# Altium schematic sheet Display.SchDoc
size A4; SheetNumber: 1; SheetTotal: 1
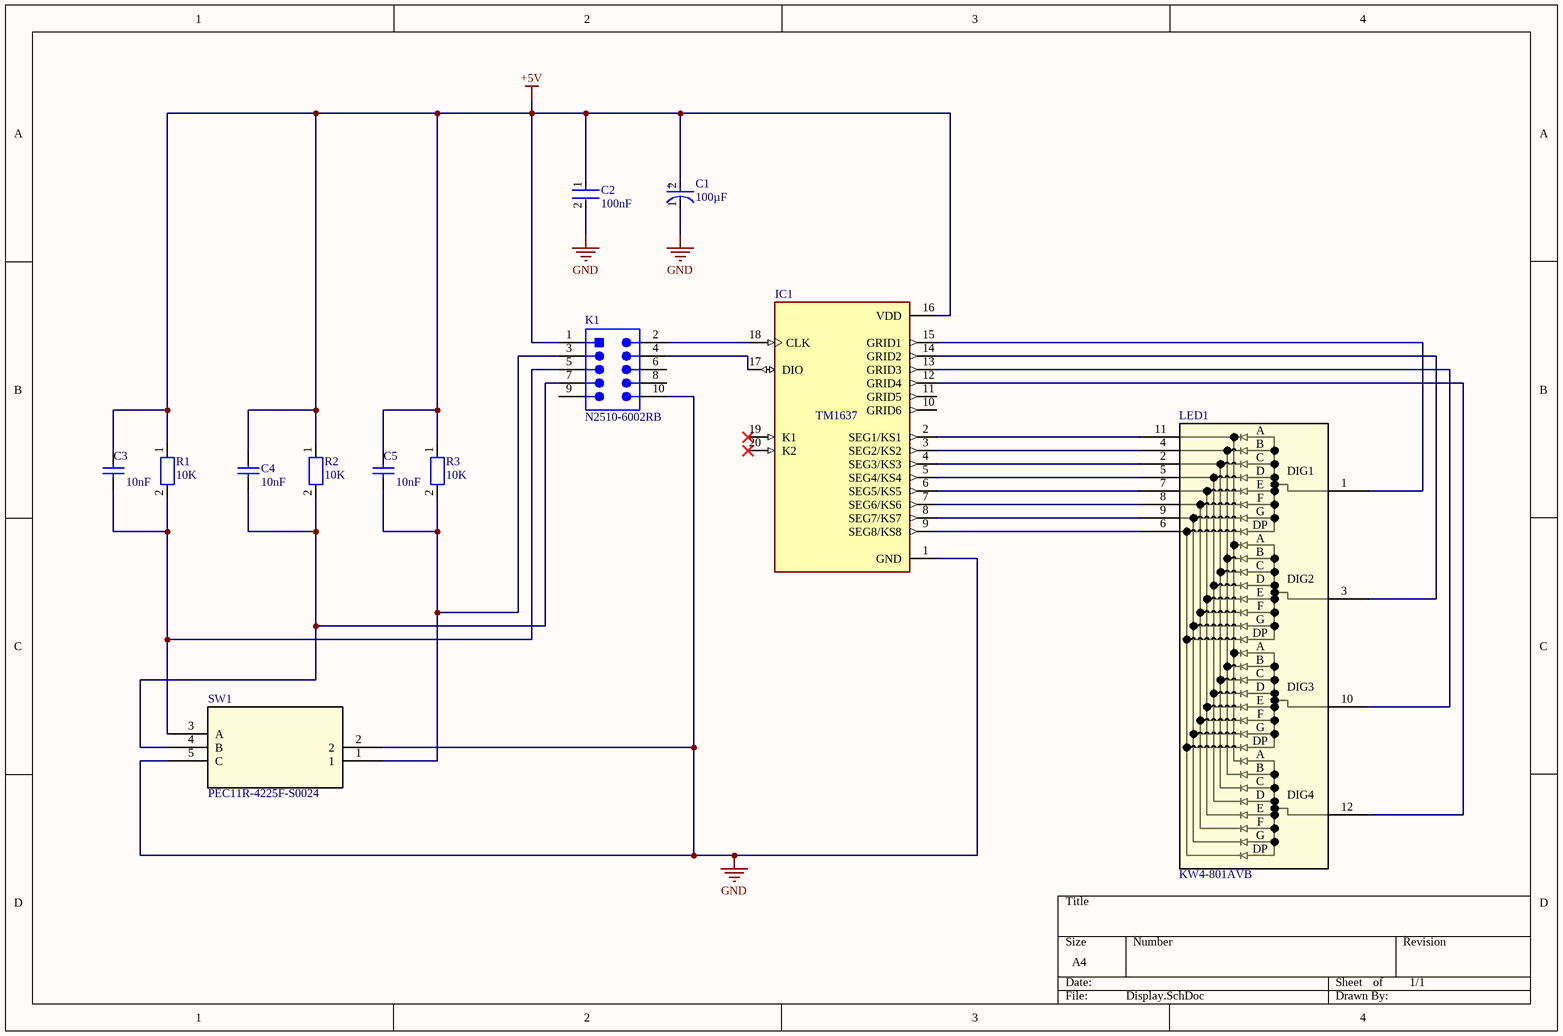
[diagram p0: Display.SchDoc]

## Parts
C1  100µF  [Cap 50V 100µF 8X11]
C2  100nF  [cap 50V 100nF A]
C3  10nF  [cap 10nF X7R 50V LL]
C4  10nF  [cap 10nF X7R 50V LL]
C5  10nF  [cap 10nF X7R 50V LL]
IC1  TM1637  [TM1637]
K1  N2510-6002RB  [boxheader]
LED1  KW4-801AVB  [KW4801AVB]
R1  10K  [Weerstand 10k ohm]
R2  10K  [Weerstand 10k ohm]
R3  10K  [Weerstand 10k ohm]
SW1  PEC11R-4225F-S0024  [SW5_PEC11R-4225F-S0024_BRN]

## Nets
+5V: C1.2(A) C2.1 C3.2 C4.2 C5.2 IC1.16(VDD) K1.1 R1.1 R2.1 R3.1
GND: C1.1(C) C2.2 IC1.1(GND) K1.10 SW1.2 SW1.5(C)
NetC3_1: C3.1 K1.5 R1.2 SW1.3(A)
NetC4_1: C4.1 K1.7 R2.2 SW1.4(B)
NetC5_1: C5.1 K1.3 R3.2 SW1.1
NetIC1_2: IC1.2(SEG1/KS1) LED1.11(CATHODE_A)
NetIC1_3: IC1.3(SEG2/KS2) LED1.4(CATHODE_B)
NetIC1_4: IC1.4(SEG3/KS3) LED1.2(CATHODE_C)
NetIC1_5: IC1.5(SEG4/KS4) LED1.5(CATHODE_D)
NetIC1_6: IC1.6(SEG5/KS5) LED1.7(CATHODE_E)
NetIC1_7: IC1.7(SEG6/KS6) LED1.8(CATHODE_F)
NetIC1_8: IC1.8(SEG7/KS7) LED1.9(CATHODE_G)
NetIC1_9: IC1.9(SEG8/KS8) LED1.6(CATHODE_DP)
NetIC1_12: IC1.12(GRID4) LED1.12(COMMON_ANODE_4)
NetIC1_13: IC1.13(GRID3) LED1.10(COMMON_ANODE_3)
NetIC1_14: IC1.14(GRID2) LED1.3(COMMON_ANODE_2)
NetIC1_15: IC1.15(GRID1) LED1.1(COMMON_ANODE_1)
NetIC1_17: IC1.17(DIO) K1.4
NetIC1_18: IC1.18(CLK) K1.2

Not connected (* = marked no-connect by the designer): IC1 10(GRID6) 11(GRID5) 19(K1)* 20(K2)*; K1 6 8 9

## Notes on the sheet
- (in symbol Cap 50V 100µF 8x11) +
- (in symbol KW4-801AVB) A; B; C; D; DIG1; E; F; G; DP; DIG2; DIG3; DIG4

## Library data of the parts
C1 = Cap 50V 100µF 8x11: Aluminum Electrolytic Capacitors (Radial Lead Type) AEC-Q200 Qualified 100uF ±20% 50V; Ripple Current (AC): 180mA; Polarity: Polar; Lead Diameter: 0.6mm; Life (Hours): 1000Hour; Lead/Base Style: Straight; Voltage Rating: 50V; Number of Pins: 2; Mount: Through Hole; Height: 11.5mm; Capacitance: 100uF; Packaging: Bulk; Diameter: 8mm; Min Operating Temperature: -55°C; Max Operating Temperature: 105°C; Case/Package: Radial; Lead Pitch: 3.5mm; Termination: Radial; Voltage: 50V; Package Quantity: 200; Construction: RADIAL; RoHS Compliant: Yes; Ripple Current: 180mA; Voltage Rating (DC): 50V; Series: HD; Tolerance: 20%; Length: 11.5mm; REACH SVHC: No SVHC; Height - Seated (Max): 0.512inch
C2 = cap 50V 100nF: Chip Multilayer Ceramic Capacitors for Automotive, 0805, 0.10uF, X7R, 15%, 10%, 50V, Grade 1; Case Code (Metric): 2012; Voltage Rating: 50V; Height: 1.25mm; Weight: 0.000335oz; Mount: Surface Mount; Width: 0.049inch; Packaging: Tape and Reel; Min Operating Temperature: -55°C; Depth: 1.25mm; Length: 2mm; Max Operating Temperature: 125°C; Ratings: AEC-Q200; Termination: SMD/SMT; Capacitance: 100nF; Thickness: 0.049inch; Case/Package: 0805; Voltage Rating (DC): 50V; Dielectric: X7R; Case Code (Imperial): 0805; Tolerance: 10%; Package Quantity: 3000
C3-C5 = cap 10nF X7R 50V: Part Number: VJ0805Y103KXACW1BC; Manufacturer: Vitramon
IC1 = TM1637: LED Drive Control Special Circuit; MF: Titan Micro Electronics; Package: Package; Availability: Not in stock; SnapEDA_Link: https://www.snapeda.com/parts/TM1637/Titan+Micro+Electronics/view-part/?ref=snap; MP: TM1637; Check_prices: https://www.snapeda.com/parts/TM1637/Titan+Micro+Electronics/view-part/?ref=eda; Value: *; Price: None
K1 = boxheader: Male Header, Pitch 2.54 mm, 2 x 5 Postion, Height 9.91 mm, Tail Length 2.84 mm, -55 to 105 degC, RoHS, Bulk; PartNumber: N2510; Manufacturer: 3M; Package Version: Rev. M, 08/2014; Rad Hard: No; No. of Rows: 2; Number of Contacts: 10; Pitch: 2.54mm; Termination Method: Solder; Manufacturer URL: http://www.3m.com/; Package Description: 10-Pin Through Hole Device, Body 20.02 x 8.59 mm, Pitch 2.54 mm; Gender: Male; Number of Rows: 2; Orientation: Straight; Contact Plating: GoldOverNickel; Packaging: Rail/Tube; Mounting Technology: ThroughHole; Datasheet URL: https://datasheet.ciiva.com/11746/0900766b807b18da-11746957.pdf; Package Reference: N2510-6002-10; Datasheet Version: 05/2007; No. of Positions: 10; Package URL: http://multimedia.3m.com/mws/media/330367O/3mtm-100-in-4-wall-hdr-rohs-lp-straightra-hitemp-ts0770.pdf; Type: ShroudedHeader
LED1 = KW4-801AVB: No Description Available; Mfr_Name: Luckylight Electronics; Type: DEV; Copyright: Copyright (C) 2023 Ultra Librarian. All rights reserved.; Manufacturer_Part_Number: KW4-801AVB; RefDes: RefDes
R1-R3 = Weerstand 10K ohm: RES Thick Film, 10kΩ, 1%, 0.125W, 100ppm/°C, 0805; Resistance: 10kR; Voltage Rating (DC): 150V; Power Rating: 125mW; Weight: 0.000194oz; Package Quantity: 5000; Military Standard: Not; Max Operating Temperature: 155°C; Temperature Coefficient: 100ppm/°C; Contact Plating: Tin; Width: 1.25mm; Height: 0.45mm; Radiation Hardening: No; Tolerance: 1%; Min Operating Temperature: -55°C; Voltage Rating: 150V; Length: 2mm; Depth: 1.25mm; Termination: SMD/SMT; Packaging: Tape and Reel; Case/Package: 0805; Case Code (Metric): 2012; Lead Free: Lead Free; Case Code (Imperial): 0805; Composition: Thick Film
SW1 = PEC11R-4225F-S0024: No Description Available; Mfr_Name: Bourns Electronics; Type: DEV; Copyright: Copyright (C) 2023 Ultra Librarian. All rights reserved.; Manufacturer_Part_Number: PEC11R-4225F-S0024; RefDes: RefDes